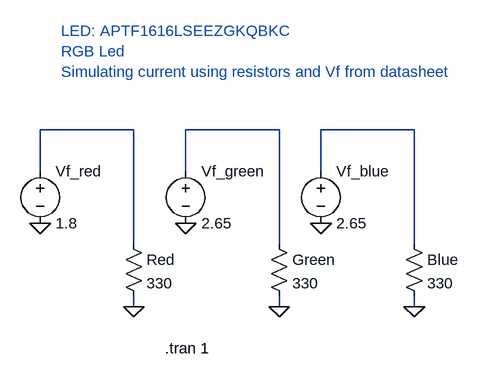
[diagram p0: schematic RGB_LED.asc]
RGB_LED.asc, the LTspice schematic file:
Version 4
SHEET 1 880 680
WIRE 176 48 32 48
WIRE 400 48 256 48
WIRE 608 48 464 48
WIRE 32 112 32 48
WIRE 256 112 256 48
WIRE 464 112 464 48
WIRE 176 224 176 48
WIRE 400 224 400 48
WIRE 608 224 608 48
WIRE 176 320 176 304
WIRE 400 320 400 304
WIRE 608 320 608 304
FLAG 176 320 0
FLAG 32 192 0
FLAG 400 320 0
FLAG 256 192 0
FLAG 608 320 0
FLAG 464 192 0
SYMBOL voltage 32 96 R0
WINDOW 123 0 0 Left 0
WINDOW 39 0 0 Left 0
SYMATTR InstName Vf_red
SYMATTR Value 1.8
SYMBOL res 160 208 R0
SYMATTR InstName Red
SYMATTR Value 330
SYMBOL voltage 256 96 R0
WINDOW 123 0 0 Left 0
WINDOW 39 0 0 Left 0
SYMATTR InstName Vf_green
SYMATTR Value 2.65
SYMBOL voltage 464 96 R0
WINDOW 123 0 0 Left 0
WINDOW 39 0 0 Left 0
SYMATTR InstName Vf_blue
SYMATTR Value 2.65
SYMBOL res 384 208 R0
SYMATTR InstName Green
SYMATTR Value 330
SYMBOL res 592 208 R0
SYMATTR InstName Blue
SYMATTR Value 330
TEXT 224 384 Left 2 !.tran 1
TEXT 64 -104 Left 2 ;LED: APTF1616LSEEZGKQBKC\nRGB Led\nSimulating current using resistors and Vf from datasheet

The netlist it stands for:
* RGB_LED.asc
Vf_red N001 0 1.8
Red N001 0 330
Vf_green N002 0 2.65
Vf_blue N003 0 2.65
R§Green N002 0 330
R§Blue N003 0 330
.tran 1
* LED: APTF1616LSEEZGKQBKC
* RGB Led
* Simulating current using resistors and Vf from datasheet
.backanno
.end